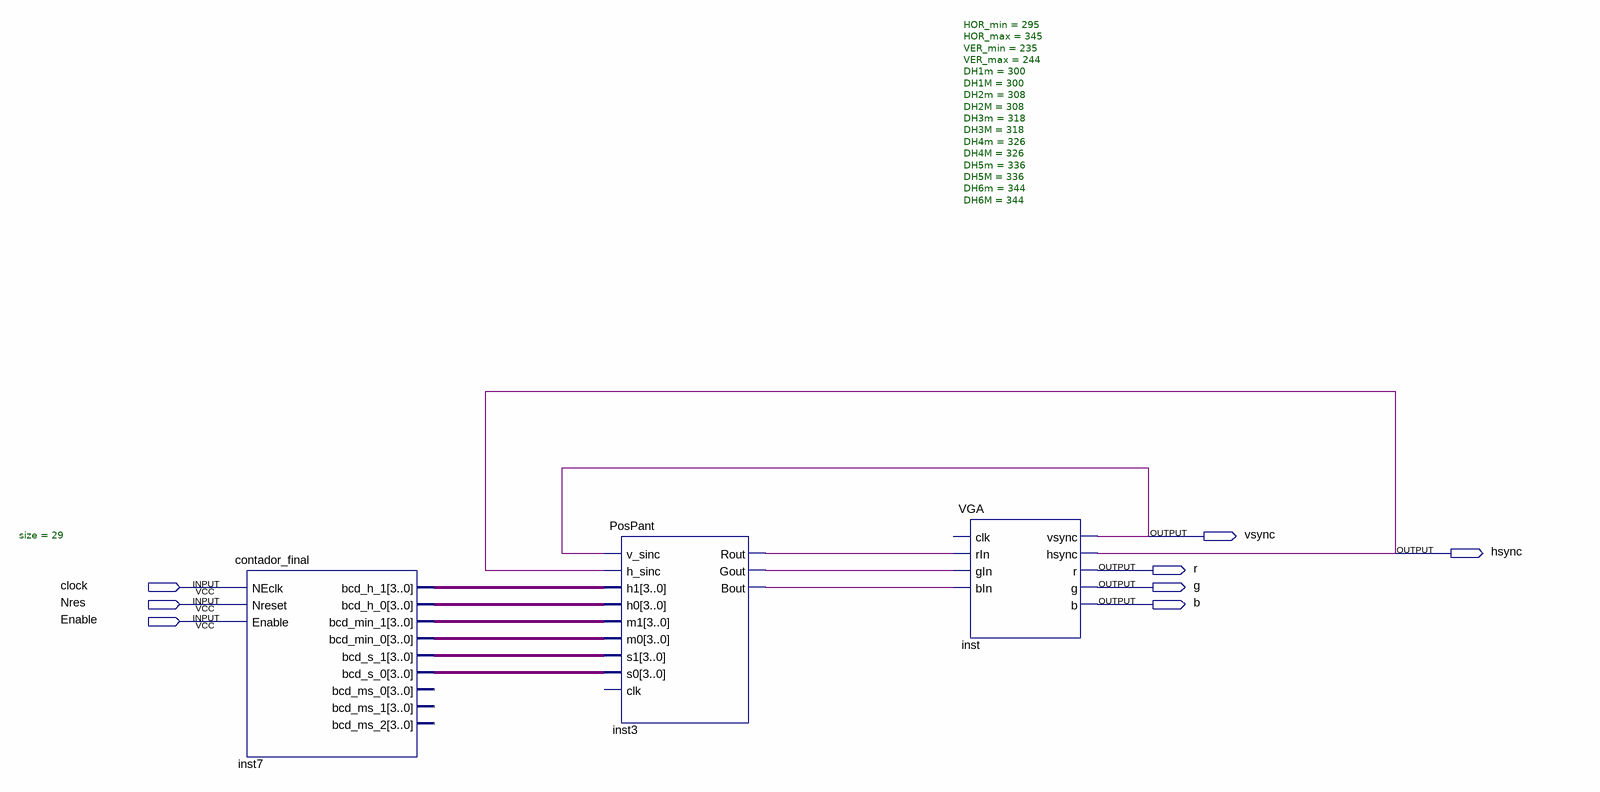
[diagram p0: schematic sheet]
// Quartus schematic main.bdf as structural Verilog: 3 symbols, 8 pins
module main (
  input  clock,
  input  Nres,
  input  Enable,
  output vsync,
  output hsync,
  output r,
  output g,
  output b
);

  wire inst3_bout, inst3_gout, inst3_rout;
  wire [3:0] inst7_bcd_h_0, inst7_bcd_h_1, inst7_bcd_min_0, inst7_bcd_min_1, inst7_bcd_s_0, inst7_bcd_s_1;

  contador_final #(.size(29)) inst7 (
    .bcd_h_1(inst7_bcd_h_1), .bcd_h_0(inst7_bcd_h_0), .bcd_min_1(inst7_bcd_min_1),
    .bcd_min_0(inst7_bcd_min_0), .bcd_s_1(inst7_bcd_s_1), .bcd_s_0(inst7_bcd_s_0));  // open: NEclk, Nreset, Enable, bcd_ms_0, bcd_ms_1, bcd_ms_2
  PosPant #(.HOR_min(295), .HOR_max(345), .VER_min(235), .VER_max(244), .DH1m(300), .DH1M(300), .DH2m(308), .DH2M(308), .DH3m(318), .DH3M(318), .DH4m(326), .DH4M(326), .DH5m(336), .DH5M(336), .DH6m(344), .DH6M(344)) inst3 (
    .v_sinc(vsync), .h_sinc(hsync), .h1(inst7_bcd_h_1), .h0(inst7_bcd_h_0), .m1(inst7_bcd_min_1),
    .m0(inst7_bcd_min_0), .s1(inst7_bcd_s_1), .s0(inst7_bcd_s_0), .Rout(inst3_rout), .Gout(inst3_gout),
    .Bout(inst3_bout));  // open: clk
  VGA inst (
    .rIn(inst3_rout), .gIn(inst3_gout), .bIn(inst3_bout), .vsync(vsync), .hsync(hsync), .r(r), .g(g), .b(b));  // open: clk
endmodule
